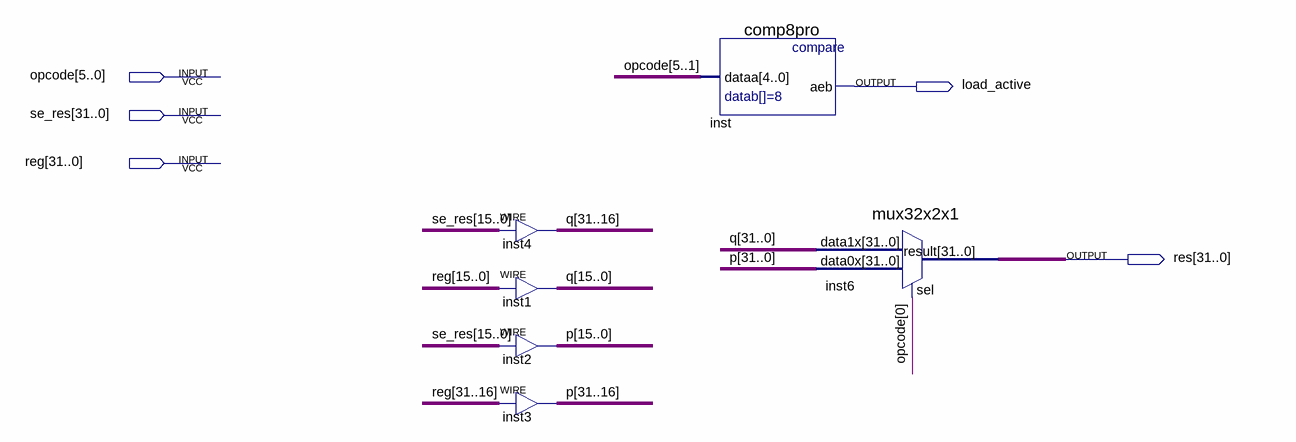
[diagram p0: schematic sheet]
// Quartus schematic load_decode.bdf as structural Verilog: 6 symbols, 5 pins
module load_decode (
  input  [5:0] opcode,
  input  [31:0] se_res,
  input  [31:0] \reg ,
  output load_active,
  output [31:0] res
);

  wire [31:0] p, q;

  assign q[31:16] = se_res[15:0];  // WIRE inst4
  assign q[15:0] = \reg [15:0];  // WIRE inst1
  assign p[15:0] = se_res[15:0];  // WIRE inst2
  assign p[31:16] = \reg [31:16];  // WIRE inst3
  comp8pro inst (.dataa(opcode[5:1]), .aeb(load_active));
  mux32x2x1 inst6 (.data1x(q), .data0x(p), .sel(opcode[0]), .result(res));
endmodule
